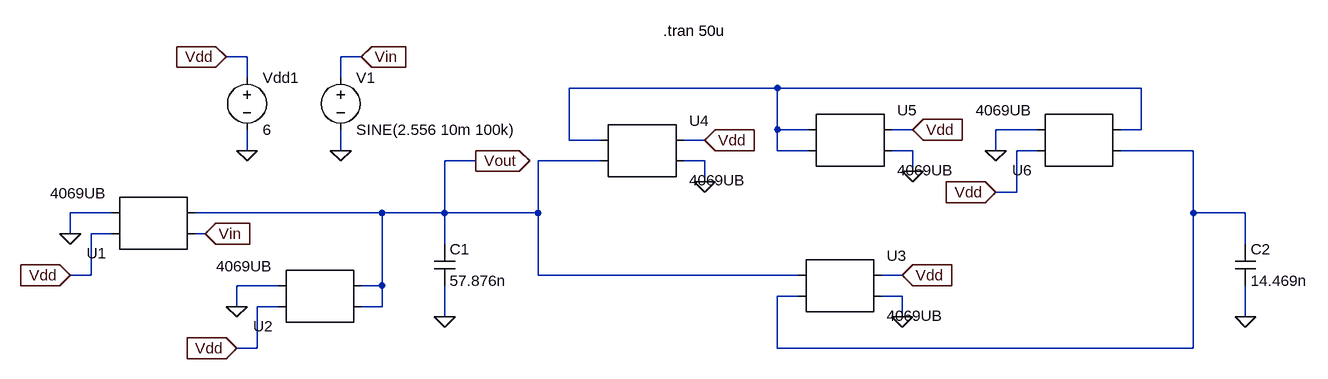
[diagram p0: schematic Q2.asc]
Q2.asc, the LTspice schematic file:
Version 4
SHEET 1 1432 680
WIRE -208 160 -240 160
WIRE -32 160 -64 160
WIRE -208 192 -208 160
WIRE -64 192 -64 160
WIRE 608 208 288 208
WIRE 1168 208 608 208
WIRE 608 272 608 208
WIRE 656 272 608 272
WIRE 816 272 784 272
WIRE 1008 272 944 272
WIRE 1168 272 1168 208
WIRE 1168 272 1136 272
WIRE 288 288 288 208
WIRE 336 288 288 288
WIRE 496 288 464 288
WIRE -208 304 -208 272
WIRE -64 304 -64 272
WIRE 608 304 608 272
WIRE 656 304 608 304
WIRE 816 304 784 304
WIRE 944 304 944 272
WIRE 1008 304 976 304
WIRE 1248 304 1136 304
WIRE 144 320 96 320
WIRE 336 320 240 320
WIRE 496 320 464 320
WIRE 816 336 816 304
WIRE 496 352 496 320
WIRE 976 368 976 304
WIRE 976 368 944 368
WIRE -416 400 -480 400
WIRE 0 400 -288 400
WIRE 96 400 96 320
WIRE 96 400 0 400
WIRE 240 400 240 320
WIRE 240 400 96 400
WIRE 1248 400 1248 304
WIRE 1328 400 1248 400
WIRE -480 432 -480 400
WIRE -416 432 -448 432
WIRE -272 432 -288 432
WIRE 96 448 96 400
WIRE 1328 448 1328 400
WIRE -448 496 -448 432
WIRE -448 496 -480 496
WIRE 240 496 240 400
WIRE 640 496 240 496
WIRE 800 496 768 496
WIRE -160 512 -224 512
WIRE 0 512 0 400
WIRE 0 512 -32 512
WIRE 640 528 608 528
WIRE 800 528 768 528
WIRE -224 544 -224 512
WIRE -160 544 -192 544
WIRE 0 544 0 512
WIRE 0 544 -32 544
WIRE 96 560 96 512
WIRE 800 560 800 528
WIRE 1328 560 1328 512
WIRE -192 608 -192 544
WIRE -192 608 -224 608
WIRE 608 608 608 528
WIRE 1248 608 1248 400
WIRE 1248 608 608 608
FLAG 800 496 Vdd
IOPIN 800 496 In
FLAG 96 560 0
FLAG 144 320 Vout
IOPIN 144 320 Out
FLAG 800 560 0
FLAG 496 288 Vdd
IOPIN 496 288 In
FLAG 496 352 0
FLAG 816 272 Vdd
IOPIN 816 272 In
FLAG 816 336 0
FLAG 1328 560 0
FLAG -480 496 Vdd
IOPIN -480 496 In
FLAG -208 304 0
FLAG -240 160 Vdd
IOPIN -240 160 In
FLAG -272 432 Vin
IOPIN -272 432 In
FLAG -64 304 0
FLAG -480 432 0
FLAG -224 608 Vdd
IOPIN -224 608 In
FLAG -224 544 0
FLAG 944 368 Vdd
IOPIN 944 368 In
FLAG 944 304 0
FLAG -32 160 Vin
IOPIN -32 160 In
SYMBOL AutoGenerated/4069UB -352 416 R180
SYMATTR InstName U1
SYMBOL AutoGenerated/4069UB -96 528 R180
SYMATTR InstName U2
SYMBOL cap 80 448 R0
SYMATTR InstName C1
SYMATTR Value 57.876n
SYMBOL AutoGenerated/4069UB 704 512 R0
SYMATTR InstName U3
SYMBOL AutoGenerated/4069UB 400 304 R0
SYMATTR InstName U4
SYMBOL AutoGenerated/4069UB 720 288 R0
SYMATTR InstName U5
SYMBOL AutoGenerated/4069UB 1072 288 R180
SYMATTR InstName U6
SYMBOL cap 1312 448 R0
SYMATTR InstName C2
SYMATTR Value 14.469n
SYMBOL voltage -208 176 R0
SYMATTR InstName Vdd1
SYMATTR Value 6
SYMBOL voltage -64 176 R0
SYMATTR InstName V1
SYMATTR Value SINE(2.556 10m 100k)
TEXT 432 120 Left 2 !.tran 50u

The netlist it stands for:
* Q2.asc
* U1: 4069UB (symbol AutoGenerated/4069UB not available, pins judged from their places): pin1=Vin pin2=Vout pin3=Vdd pin4=0
* U2: 4069UB (symbol AutoGenerated/4069UB not available, pins judged from their places): pin1=Vout pin2=Vout pin3=Vdd pin4=0
C1 Vout 0 57.876n
* U3: 4069UB (symbol AutoGenerated/4069UB not available, pins judged from their places): pin1=Vout pin2=N002 pin3=Vdd pin4=0
* U4: 4069UB (symbol AutoGenerated/4069UB not available, pins judged from their places): pin1=N001 pin2=Vout pin3=Vdd pin4=0
* U5: 4069UB (symbol AutoGenerated/4069UB not available, pins judged from their places): pin1=N001 pin2=N001 pin3=Vdd pin4=0
* U6: 4069UB (symbol AutoGenerated/4069UB not available, pins judged from their places): pin1=N002 pin2=N001 pin3=Vdd pin4=0
C2 N002 0 14.469n
Vdd1 Vdd 0 6
V1 Vin 0 SINE(2.556 10m 100k)
.tran 50u
.backanno
.end